# Altium schematic sheet mix.SchDoc
size 279 x 355 mm
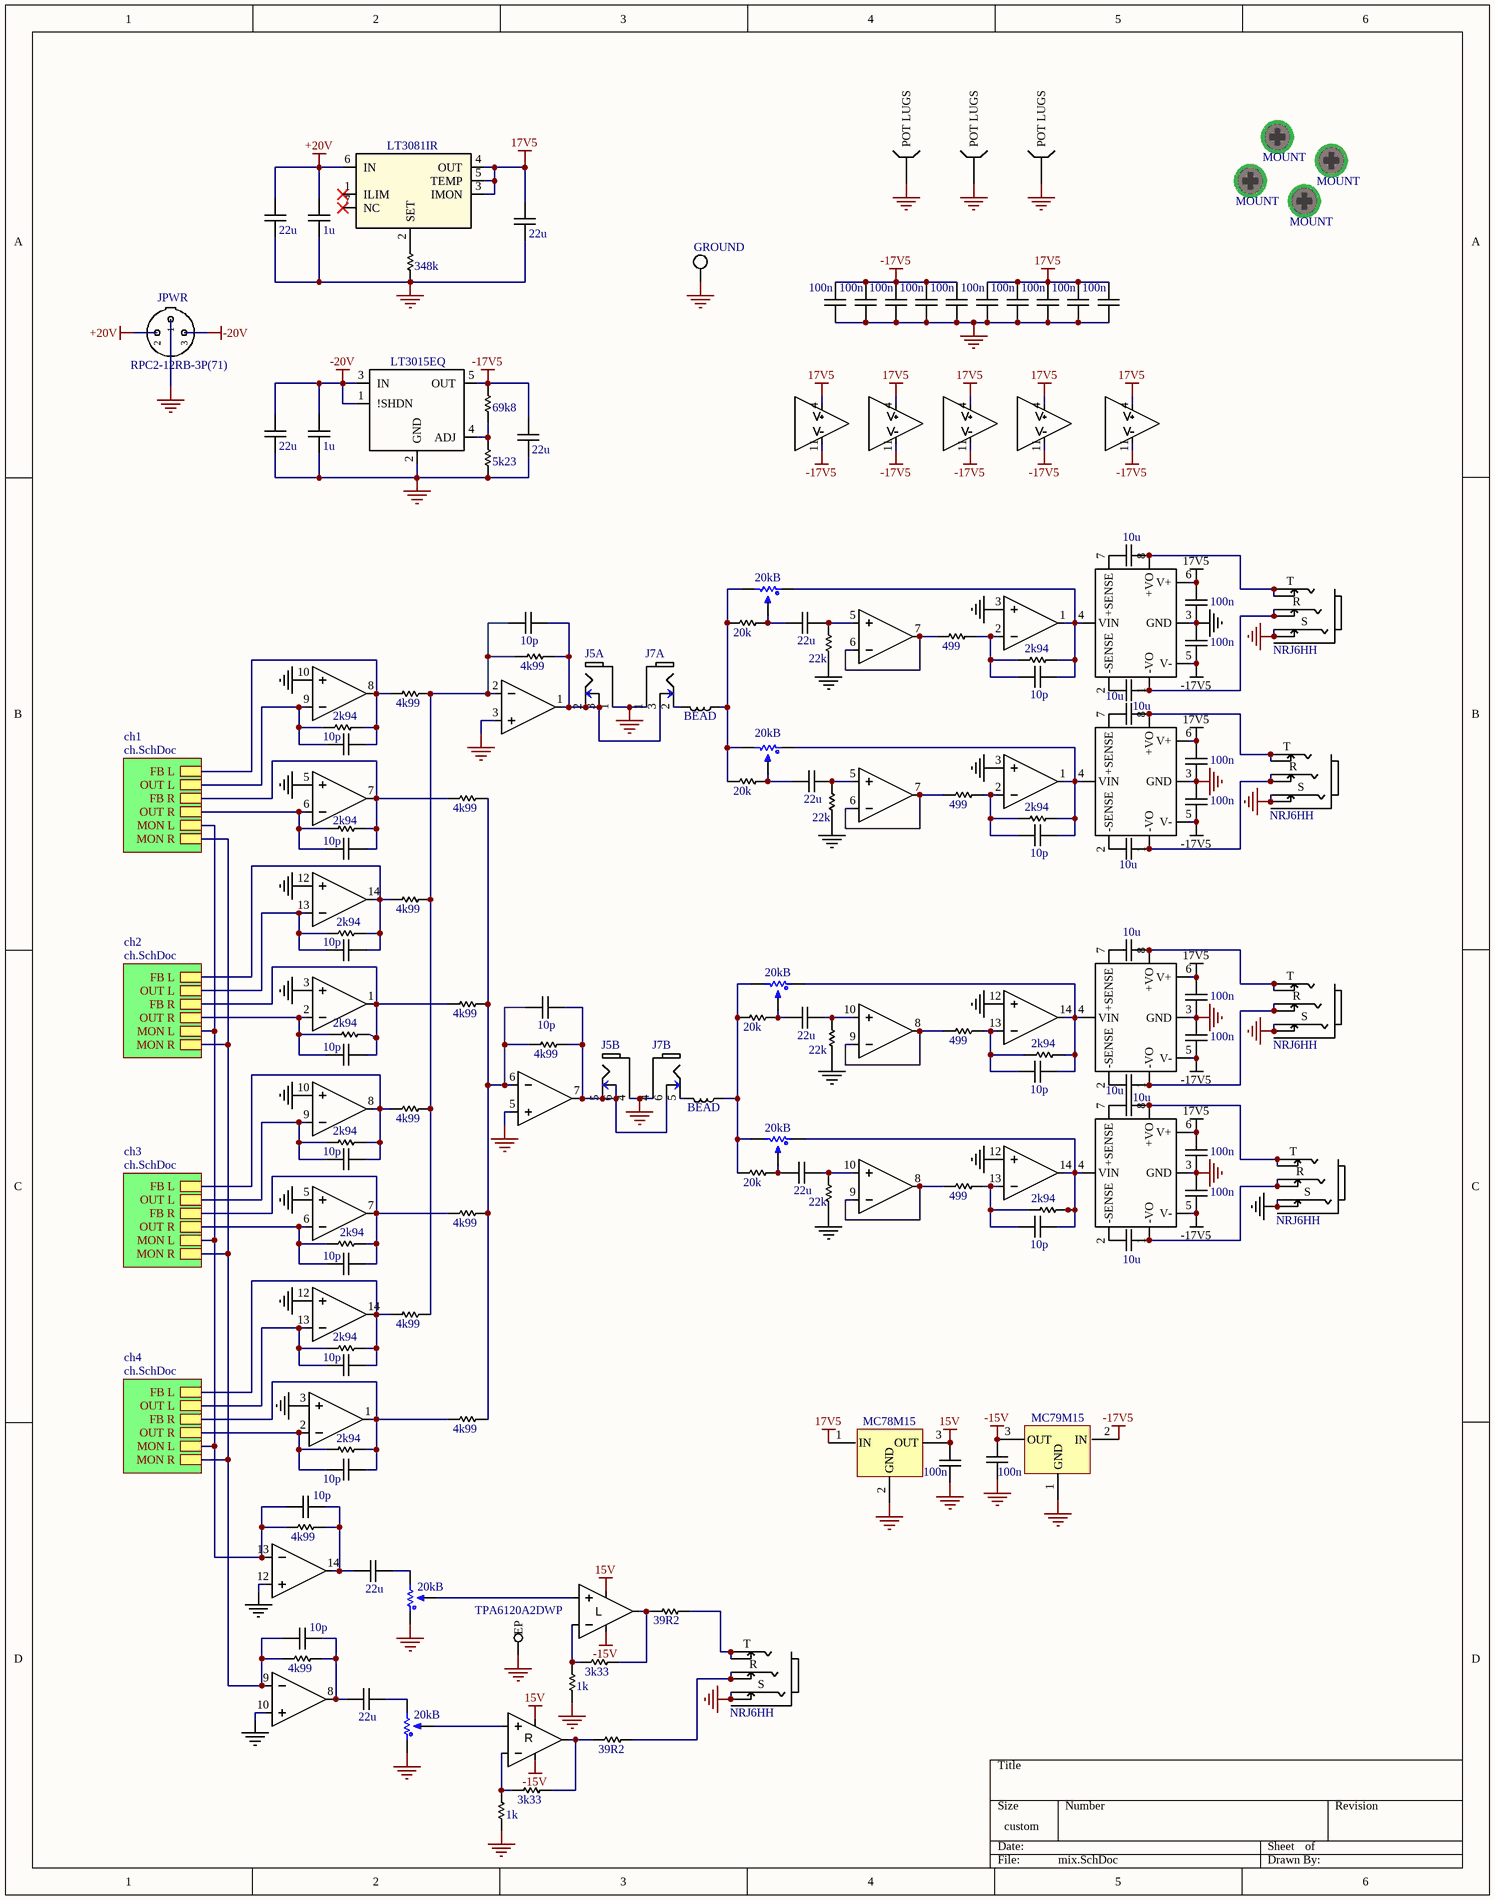
[diagram p0: mix.SchDoc]

## Parts
C5  100n  [0805]
C7  100n  [0805]
C15  100n  [0805]
C17  100n  [0805]
C23  10p  [0805]
C24  100n  [0805]
C26  100n  [0805]
C31  100n  [0805]
C33  100n  [0805]
C36  22u  [0805]
C37  10p  [0805]
C38  100n  [0805]
C39  22u  [0805]
C40  100n  [0805]
C41  10p  [0805]
C43  10p  [0805]
C45  10p  [0805]
C46  100n  [0805]
C47  10p  [0805]
C48  22u  [0805]
C49  100n  [0805]
C50  10p  [0805]
C52  22u  [0805]
C54  10p  [0805]
C55  22u  [0805]
C56  10p  [0805]
C57  22u  [0805]
C58  10p  [0805]
C59  10p  [0805]
C60  10p  [0805]
C61  10p  [0805]
C62  10p  [0805]
C63  10p  [0805]
C64  10p  [0805]
C983  22u  [0805]
C984  1u  [0805]
C985  22u  [0805]
C988  22u  [0805]
C989  1u  [0805]
C990  22u  [0805]
C1002  100n  [0805]
C1003  100n  [0805]
C1004  100n  [0805]
C1005  100n  [0805]
C1006  100n  [0805]
C1007  100n  [0805]
C1008  100n  [0805]
C1010  100n  [0805]
C2001  10u  [0805]
C2002  10u  [0805]
C2003  10u  [0805]
C2004  10u  [0805]
C2005  10u  [0805]
C2006  10u  [0805]
C2007  10u  [0805]
C2008  10u  [0805]
GROUND  PHONO  [PAD]  (value not drawn)  (no BOM)
J1  NRJ6HH  [NRJ6HH]
J2  NRJ6HH  [NRJ6HH]
J3  NRJ6HH  [NRJ6HH]
J4  NRJ6HH  [NRJ6HH]
J5  PJRAN2X1U01AUX  [PJRAN2X1U01AUX]  (value not drawn)  (parts A,B of 2)
J6  NRJ6HH  [NRJ6HH]
J7  PJRAN2X1U01AUX  [PJRAN2X1U01AUX]  (value not drawn)  (parts A,B of 2)
JPWR  RPC2-12RB-3P(71)  [RPC2-12RB-3P(71)]
L3  BEAD  [0805]
L4  BEAD  [0805]
MH1  MOUNT  [MOUNT]  (no BOM)
MH2  MOUNT  [MOUNT]  (no BOM)
MH3  MOUNT  [MOUNT]  (no BOM)
MH4  MOUNT  [MOUNT]  (no BOM)
R5  20kB  [P0925N-FC15AR10K]  (parts A,B,C of 3)
R6  20kB  [P0925N-FC15AR10K]  (parts A,B,C of 3)
R7  20kB  [P0925N-FC15AR10K]  (parts A,B,C of 3)
R13  4k99  [0805]
R26  3k33  [0805]
R27  3k33  [0805]
R29  1k  [0805]
R30  39R2  [0805]
R31  39R2  [0805]
R32  1k  [0805]
R47  499  [0805]
R49  22k  [0805]
R50  2k94  [0805]
R51  4k99  [0805]
R71  20k  [0805]
R75  20k  [0805]
R76  499  [0805]
R77  2k94  [0805]
R78  22k  [0805]
R79  2k94  [0805]
R80  4k99  [0805]
R81  2k94  [0805]
R82  4k99  [0805]
R83  2k94  [0805]
R84  499  [0805]
R85  4k99  [0805]
R86  22k  [0805]
R87  2k94  [0805]
R88  4k99  [0805]
R89  2k94  [0805]
R90  499  [0805]
R91  22k  [0805]
R92  4k99  [0805]
R93  2k94  [0805]
R94  2k94  [0805]
R95  4k99  [0805]
R96  2k94  [0805]
R97  4k99  [0805]
R98  2k94  [0805]
R99  4k99  [0805]
R100  2k94  [0805]
R101  348k  [0805]
R102  5k23  [0805]
R103  69k8  [0805]
R104  20k  [0805]
R105  20k  [0805]
R106  4k99  [0805]
R107  4k99  [0805]
U6  OPA16X4  [SOIC127P600X175-14M]  (value not drawn)  (parts A,B,C,D,E of 5)
U7  OPA16X4  [SOIC127P600X175-14M]  (value not drawn)  (parts A,B,C,D,E of 5)
U8  OPA16X4  [SOIC127P600X175-14M]  (value not drawn)  (parts A,B,C,D,E of 5)
U9  OPA16X4  [SOIC127P600X175-14M]  (value not drawn)  (parts A,B,C,D,E of 5)
U10  OPA16X4  [SOIC127P600X175-14M]  (value not drawn)  (parts A,B,C,D,E of 5)
U11  LT3081IR  [DDPAK-7]
U12  LT3015EQ  [DDPAK-5_Q]
U13  DRV135  [SOIC127P600X175-8M]  (value not drawn)
U14  DRV135  [SOIC127P600X175-8M]  (value not drawn)
U15  DRV135  [SOIC127P600X175-8M]  (value not drawn)
U16  DRV135  [SOIC127P600X175-8M]  (value not drawn)
U17  TPA6120A2DWP  [SOIC127P1040X265_HS-21M]  (parts A,B,C of 3)
U18  MC78M15  [DPAK-3]
U19  MC79M15  [DPAK-3]

## Sub-sheets
ch1 = ch.SchDoc: OUT L, OUT R, MON L, MON R, FB L, FB R
ch2 = ch.SchDoc: OUT L, OUT R, MON L, MON R, FB L, FB R
ch3 = ch.SchDoc: OUT L, OUT R, MON L, MON R, FB L, FB R
ch4 = ch.SchDoc: OUT L, OUT R, MON L, MON R, FB L, FB R

## Nets
15V: C1002.1 U17.3(LV+) U17.18(RV+) U18.3(OUT)
17V5: C15.1 C17.1 C24.1 C31.1 C38.1 C46.1 C985.2 C1005.1 C1007.1 C1010.1 U6.4(V+) U7.4(V+) U8.4(V+) U9.4(V+) U10.4(V+) U11.3(IMON) U11.4(OUT) U11.5(TEMP) U13.6(V+) U14.6(V+) U15.6(V+) U16.6(V+) U18.1(IN)
+20V: C983.2 C984.2 JPWR.2 U11.6(IN)
-15V: C1003.1 U17.1(LV-) U17.20(RV-) U19.3(OUT)
-17V5: C5.1 C7.1 C26.2 C33.2 C40.2 C49.2 C990.2 C1004.1 C1006.1 C1008.1 R103.2 U6.11(V-) U7.11(V-) U8.11(V-) U9.11(V-) U10.11(V-) U12.5(OUT) U13.5(V-) U14.5(V-) U15.5(V-) U16.5(V-) U19.2(IN)
-20V: C988.2 C989.2 JPWR.3 U12.1(!SHDN) U12.3(IN)
GND: C5.2 C7.2 C15.2 C17.2 C24.2 C26.1 C31.2 C33.1 C38.2 C40.1 C46.2 C49.1 C983.1 C984.1 C985.1 C988.1 C989.1 C990.1 C1002.2 C1003.2 C1004.2 C1005.2 C1006.2 C1007.2 C1008.2 C1010.2 GROUND.1 J1.S J1.SN J2.S J2.SN J3.S J3.SN J4.S J4.SN J5.1 J5.4 J6.S J6.SN J7.1 J7.4 JPWR.1 R5.7(POT_LUGS) R6.7(POT_LUGS) R7.1 R7.4 R7.7(POT_LUGS) R29.1 R32.1 R49.1 R78.1 R86.1 R91.1 R101.1 R102.1 U6.3(+IN_A) U6.5(IN_B+) U6.10(IN_C+) U6.12(IN_D+) U7.3(+IN_A) U7.5(IN_B+) U7.10(IN_C+) U7.12(IN_D+) U8.3(+IN_A) U8.12(IN_D+) U9.3(+IN_A) U9.12(IN_D+) U10.3(+IN_A) U10.5(IN_B+) U10.10(IN_C+) U10.12(IN_D+) U12.2(GND) U13.3(GND) U14.3(GND) U15.3(GND) U16.3(GND) U17.21(EP) U18.2(GND) U19.1(GND)
NetC23_1: C23.1 R13.1 R51.2 R82.2 R92.2 R97.2 U10.2(-IN_A)
NetC23_2: C23.2 J5.2 J5.3 J7.3 R13.2 U10.1(OUT_A)
NetC36_1: C36.1 R5.2 R71.1
NetC36_2: C36.2 R49.2 U9.5(IN_B+)
NetC37_1: C37.1 R47.2 R50.1 U9.2(-IN_A)
NetC37_2: C37.2 R5.1 R50.2 U9.1(OUT_A) U13.4(VIN)
NetC39_1: C39.1 R6.2 R75.1
NetC39_2: C39.2 R78.2 U8.5(IN_B+)
NetC41_1: C41.1 R77.1 U6.9(IN_C-) ; sheet ch1/OUT L
NetC41_2: C41.2 R51.1 R77.2 U6.8(OUT_C) ; sheet ch1/FB L
NetC43_1: C43.1 R76.2 R79.1 U8.2(-IN_A)
NetC43_2: C43.2 R6.1 R79.2 U8.1(OUT_A) U14.4(VIN)
NetC45_1: C45.1 R81.1 U6.6(IN_B-) ; sheet ch1/OUT R
NetC45_2: C45.2 R80.1 R81.2 U6.7(OUT_B) ; sheet ch1/FB R
NetC47_1: C47.1 R80.2 R85.1 R88.2 R95.2 R99.2 U10.6(IN_B-)
NetC47_2: C47.2 J5.5 J5.6 J7.6 R85.2 U10.7(OUT_B)
NetC48_1: C48.1 R5.5 R104.1
NetC48_2: C48.2 R86.2 U9.10(IN_C+)
NetC50_1: C50.1 R83.1 U6.13(IN_D-) ; sheet ch2/OUT L
NetC50_2: C50.2 R82.1 R83.2 U6.14(OUT_D) ; sheet ch2/FB L
NetC52_1: C52.1 C63.2 R106.2 U10.14(OUT_D)
NetC52_2: C52.2 R7.3
NetC54_1: C54.1 R84.2 R87.1 U9.13(IN_D-)
NetC54_2: C54.2 R5.4 R87.2 U9.14(OUT_D) U15.4(VIN)
NetC55_1: C55.1 C64.2 R107.2 U10.8(OUT_C)
NetC55_2: C55.2 R7.6
NetC56_1: C56.1 R89.1 U6.2(-IN_A) ; sheet ch2/OUT R
NetC56_2: C56.2 R88.1 R89.2 U6.1(OUT_A) ; sheet ch2/FB R
NetC57_1: C57.1 R6.5 R105.1
NetC57_2: C57.2 R91.2 U8.10(IN_C+)
NetC58_1: C58.1 R90.2 R93.1 U8.13(IN_D-)
NetC58_2: C58.2 R6.4 R93.2 U8.14(OUT_D) U16.4(VIN)
NetC59_1: C59.1 R94.1 U7.9(IN_C-) ; sheet ch3/OUT L
NetC59_2: C59.2 R92.1 R94.2 U7.8(OUT_C) ; sheet ch3/FB L
NetC60_1: C60.1 R96.1 U7.6(IN_B-) ; sheet ch3/OUT R
NetC60_2: C60.2 R95.1 R96.2 U7.7(OUT_B) ; sheet ch3/FB R
NetC61_1: C61.1 R98.1 U7.13(IN_D-) ; sheet ch4/OUT L
NetC61_2: C61.2 R97.1 R98.2 U7.14(OUT_D) ; sheet ch4/FB L
NetC62_1: C62.1 R100.1 U7.2(-IN_A) ; sheet ch4/OUT R
NetC62_2: C62.2 R99.1 R100.2 U7.1(OUT_A) ; sheet ch4/FB R
NetC63_1: C63.1 R106.1 U10.13(IN_D-) ; sheet ch1/MON L, sheet ch2/MON L, sheet ch3/MON L, sheet ch4/MON L
NetC64_1: C64.1 R107.1 U10.9(IN_C-) ; sheet ch1/MON R, sheet ch2/MON R, sheet ch3/MON R, sheet ch4/MON R
NetC2001_1: C2001.1 U13.7(+SENSE)
NetC2001_2: C2001.2 J1.T J1.TN U13.8(+VO)
NetC2002_1: C2002.1 U13.2(-SENSE)
NetC2002_2: C2002.2 J1.R J1.RN U13.1(-VO)
NetC2003_1: C2003.1 U14.7(+SENSE)
NetC2003_2: C2003.2 J2.T J2.TN U14.8(+VO)
NetC2004_1: C2004.1 U14.2(-SENSE)
NetC2004_2: C2004.2 J2.R J2.RN U14.1(-VO)
NetC2005_1: C2005.1 U15.7(+SENSE)
NetC2005_2: C2005.2 J3.T J3.TN U15.8(+VO)
NetC2006_1: C2006.1 U15.2(-SENSE)
NetC2006_2: C2006.2 J3.R J3.RN U15.1(-VO)
NetC2007_1: C2007.1 U16.7(+SENSE)
NetC2007_2: C2007.2 J4.T J4.TN U16.8(+VO)
NetC2008_1: C2008.1 U16.2(-SENSE)
NetC2008_2: C2008.2 J4.R J4.RN U16.1(-VO)
NetJ6_R: J6.R J6.RN R31.2
NetJ6_T: J6.T J6.TN R30.2
NetJ7_2: J7.2 L3.2
NetJ7_5: J7.5 L4.2
NetL3_1: L3.1 R5.3 R6.3 R71.2 R75.2
NetL4_1: L4.1 R5.6 R6.6 R104.2 R105.2
NetR7_2: R7.2 U17.4(LIN+)
NetR7_5: R7.5 U17.17(RIN+)
NetR26_1: R26.1 R32.2 U17.16(RIN-)
NetR26_2: R26.2 R31.1 U17.19(ROUT)
NetR27_1: R27.1 R29.2 U17.5(LIN-)
NetR27_2: R27.2 R30.1 U17.2(LOUT)
NetR47_1: R47.1 U9.6(IN_B-) U9.7(OUT_B)
NetR76_1: R76.1 U8.6(IN_B-) U8.7(OUT_B)
NetR84_1: R84.1 U9.8(OUT_C) U9.9(IN_C-)
NetR90_1: R90.1 U8.8(OUT_C) U8.9(IN_C-)
NetR101_2: R101.2 U11.2(SET)
NetR102_2: R102.2 R103.1 U12.4(ADJ)

Not connected (* = marked no-connect by the designer): U11 1(ILIM)* 7(NC)*

## Notes on the sheet
- (in symbol TPA6120A2DWP, part A) L
- (in symbol TPA6120A2DWP, part B) R

## Library data of the parts
C5 C7 C15 C17 C24 C26 C31 C33 C38 C40 C46 C49 C1002-C1008 C1010 = CAP: PartNumber: C0805C104K1RAC7800; Supplier 1: Arrow; Supplier Part Number 1: C0805C104K1RAC7800
C23 C37 C41 C43 C45 C47 C50 C54 C56 C58-C64 = CAP: PartNumber: CC0805JRNPO9BN100; Supplier 1: Arrow; Supplier Part Number 1: CC0805JRNPO9BN100
C36 C39 C48 C52 C55 C57 C983 C985 C988 C990 = CAP: PartNumber: GRT21BR61E226ME13L; Supplier 1: Arrow; Supplier Part Number 1: GRT21BR61E226ME13L
  C983 C985 C988 C990: Value: 22u
C984 C989 = CAP: PartNumber: CL21B105KBFNNNF; Value: 1u; Supplier 1: Arrow; Supplier Part Number 1: CL21B105KBFNNNF
C2001-C2008 = CAP: PartNumber: NMC0805X5R106K25TRPLP2KF; Supplier 1: Arrow; Supplier Part Number 1: NMC0805X5R106K25TRPLP2KF
GROUND = PAD: Supplier 1: Arrow
J1-J4 J6 = NRJ6HH: PartNumber: NRJ6HH-AU; Supplier 1: Arrow; Supplier Part Number 1: NRJ6HH-AU
L3 L4 = BLM21PG121SH1D: Supplier 1: Arrow; Supplier Part Number 1: BLM21PG121SH1D; PartNumber: BLM21PG121SH1D
R5-R7 = P0925N-FC15BR20K: Supplier 1: Arrow; Supplier Part Number 1: P0925N-FC15BR20K; PartNumber: P0925N-FC15BR20K
R13 R51 R80 R82 R85 R88 R92 R95 R97 R99 R106 R107 = RES: PartNumber: ERJ-6ENF4991V; Supplier 1: Arrow; Supplier Part Number 1: ERJ-6ENF4991V
R26 R27 = RES: PartNumber: ERJ-6ENF1002V; Supplier 1: Arrow; Supplier Part Number 1: ERJ-6ENF1002V
R29 R32 = RES: PartNumber: ERJ-6ENF1001V; Supplier 1: Arrow; Supplier Part Number 1: ERJ-6ENF1001V
R30 R31 = RES: PartNumber: ERJ-6ENF39R2V; Supplier 1: Arrow; Supplier Part Number 1: ERJ-6ENF39R2V
R47 R76 R84 R90 = RES: PartNumber: ERJ-6ENF4990V; Supplier 1: Arrow; Supplier Part Number 1: ERJ-6ENF4990V
R49 R78 R86 R91 = RES: PartNumber: ERJ-6ENF2202V; Supplier 1: Arrow; Supplier Part Number 1: ERJ-6ENF2202V
R50 R77 R79 R81 R83 R87 R89 R93 R94 R96 R98 R100 = RES: PartNumber: ERJ-6ENF2941V; Supplier 1: Arrow; Supplier Part Number 1: ERJ-6ENF2941V
R71 R75 R104 R105 = RES: PartNumber: ERJ-6ENF2002V; Supplier 1: Arrow; Supplier Part Number 1: ERJ-6ENF2002V
R101 = RES: PartNumber: ERJ-PB6B3483V; Supplier 1: Arrow; Supplier Part Number 1: ERJ-PB6B3483V
R102 = RES: PartNumber: ERJ-PB6B5231V; Supplier 1: Arrow; Supplier Part Number 1: ERJ-PB6B5231V
R103 = RES: PartNumber: ERJ-PB6B6982V; Supplier 1: Arrow; Supplier Part Number 1: ERJ-PB6B6982V
U6-U10 = OPA16X4: PartNumber: OPA1664AIDR; Supplier 1: Arrow; Supplier Part Number 1: OPA1664AIDR
U11 = LT3081IR: Imported; PartNumber: LT3081IR#PBF; Supplier 1: Arrow; Supplier Part Number 1: LT3081IR#PBF
U12 = LT3015EQ: PartNumber: LT3015EQ#PBF; Supplier 1: Arrow; Supplier Part Number 1: LT3015EQ#PBF
U13-U16 = DRV135UA: PartNumber: DRV135UAG4; Supplier 1: Arrow; Supplier Part Number 1: DRV135UAG4
U17 = TPA6120A2DWP: PartNumber: TPA6120A2DWPR; Supplier 1: Arrow; Supplier Part Number 1: TPA6120A2DWPR
U18 = MC78M15CDTRKG: Supplier 1: Arrow; Supplier Part Number 1: MC78M15CDTRKG; PartNumber: MC78M15CDTRKG
U19 = MC79M15CDTRKG: Supplier 1: Arrow; Supplier Part Number 1: MC79M15CDTRKG; PartNumber: MC79M15CDTRKG
J5 J7 = PJRAN2X1U01AUX: Supplier 1: Arrow; Supplier Part Number 1: PJRAN2X1U01AUX; PartNumber: PJRAN2X1U01AUX
JPWR = RPC2-12RB-3P(71): Supplier 1: Arrow
MH1-MH4 = MOUNT: Supplier 1: Arrow